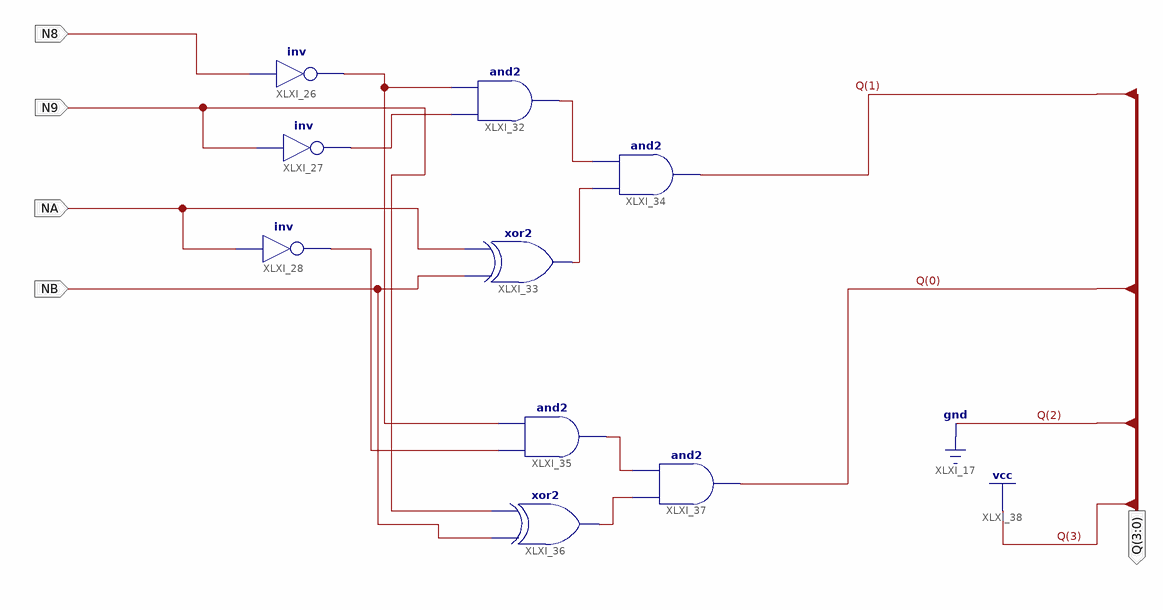
[diagram p0: schematic sheet 1]
// Xilinx ISE schematic NUM8B.sch (spartan6) as structural Verilog: 9 symbols, 5 ports
module NUM8B (
  input  NA,
  input  NB,
  input  N8,
  input  N9,
  output [3:0] Q
);

  wire XLXN_81, XLXN_82, XLXN_83, XLXN_84, XLXN_86, XLXN_88, XLXN_89;

  not XLXI_27 (XLXN_82, N9);
  not XLXI_28 (XLXN_86, NA);
  not XLXI_26 (XLXN_81, N8);
  and XLXI_32 (XLXN_83, XLXN_82, XLXN_81);
  xor XLXI_33 (XLXN_84, NB, NA);
  and XLXI_34 (Q[1], XLXN_84, XLXN_83);
  and XLXI_35 (XLXN_88, XLXN_86, XLXN_81);
  xor XLXI_36 (XLXN_89, NB, N9);
  and XLXI_37 (Q[0], XLXN_89, XLXN_88);

  assign Q[3:2] = 2'b10;
endmodule
